# Altium schematic sheet BNC.SchDoc
size A4; SheetNumber: 1; SheetTotal: 1
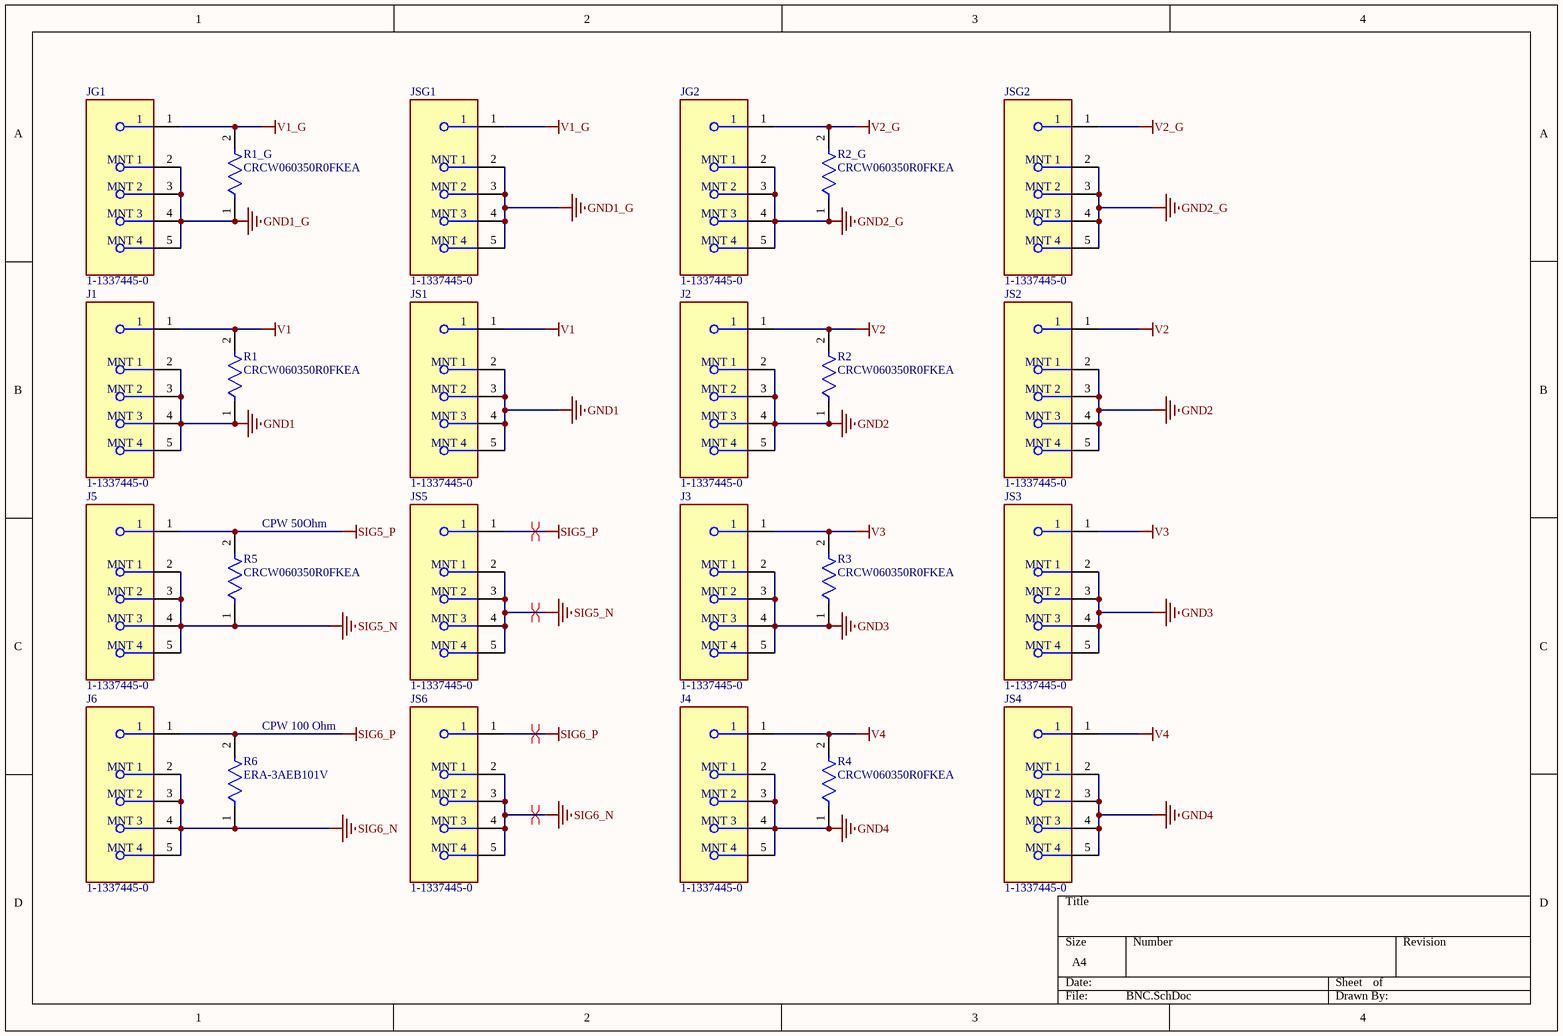
[diagram p0: BNC.SchDoc]

## Parts
J1  1-1337445-0  [FP-1-1337445-0-MFG]
J2  1-1337445-0  [FP-1-1337445-0-MFG]
J3  1-1337445-0  [FP-1-1337445-0-MFG]
J4  1-1337445-0  [FP-1-1337445-0-MFG]
J5  1-1337445-0  [FP-1-1337445-0-MFG]
J6  1-1337445-0  [FP-1-1337445-0-MFG]
JG1  1-1337445-0  [FP-1-1337445-0-MFG]
JG2  1-1337445-0  [FP-1-1337445-0-MFG]
JS1  1-1337445-0  [FP-1-1337445-0-MFG]
JS2  1-1337445-0  [FP-1-1337445-0-MFG]
JS3  1-1337445-0  [FP-1-1337445-0-MFG]
JS4  1-1337445-0  [FP-1-1337445-0-MFG]
JS5  1-1337445-0  [FP-1-1337445-0-MFG]
JS6  1-1337445-0  [FP-1-1337445-0-MFG]
JSG1  1-1337445-0  [FP-1-1337445-0-MFG]
JSG2  1-1337445-0  [FP-1-1337445-0-MFG]
R1  CRCW060350R0FKEA  [FP-CRCW0603-e3-MFG]
R1_G  CRCW060350R0FKEA  [FP-CRCW0603-e3-MFG]
R2  CRCW060350R0FKEA  [FP-CRCW0603-e3-MFG]
R2_G  CRCW060350R0FKEA  [FP-CRCW0603-e3-MFG]
R3  CRCW060350R0FKEA  [FP-CRCW0603-e3-MFG]
R4  CRCW060350R0FKEA  [FP-CRCW0603-e3-MFG]
R5  CRCW060350R0FKEA  [FP-CRCW0603-e3-MFG]
R6  ERA-3AEB101V  [FP-ERA3A-IPC_B]

## Nets
GND1: J1.2(MNT_1) J1.3(MNT_2) J1.4(MNT_3) J1.5(MNT_4) JS1.2(MNT_1) JS1.3(MNT_2) JS1.4(MNT_3) JS1.5(MNT_4) R1.1
GND1_G: JG1.2(MNT_1) JG1.3(MNT_2) JG1.4(MNT_3) JG1.5(MNT_4) JSG1.2(MNT_1) JSG1.3(MNT_2) JSG1.4(MNT_3) JSG1.5(MNT_4) R1_G.1
GND2: J2.2(MNT_1) J2.3(MNT_2) J2.4(MNT_3) J2.5(MNT_4) JS2.2(MNT_1) JS2.3(MNT_2) JS2.4(MNT_3) JS2.5(MNT_4) R2.1
GND2_G: JG2.2(MNT_1) JG2.3(MNT_2) JG2.4(MNT_3) JG2.5(MNT_4) JSG2.2(MNT_1) JSG2.3(MNT_2) JSG2.4(MNT_3) JSG2.5(MNT_4) R2_G.1
GND3: J3.2(MNT_1) J3.3(MNT_2) J3.4(MNT_3) J3.5(MNT_4) JS3.2(MNT_1) JS3.3(MNT_2) JS3.4(MNT_3) JS3.5(MNT_4) R3.1
GND4: J4.2(MNT_1) J4.3(MNT_2) J4.4(MNT_3) J4.5(MNT_4) JS4.2(MNT_1) JS4.3(MNT_2) JS4.4(MNT_3) JS4.5(MNT_4) R4.1
SIG5_N: J5.2(MNT_1) J5.3(MNT_2) J5.4(MNT_3) J5.5(MNT_4) JS5.2(MNT_1) JS5.3(MNT_2) JS5.4(MNT_3) JS5.5(MNT_4) R5.1
SIG5_P: J5.1 JS5.1 R5.2
SIG6_N: J6.2(MNT_1) J6.3(MNT_2) J6.4(MNT_3) J6.5(MNT_4) JS6.2(MNT_1) JS6.3(MNT_2) JS6.4(MNT_3) JS6.5(MNT_4) R6.1
SIG6_P: J6.1 JS6.1 R6.2
V1: J1.1 JS1.1 R1.2
V1_G: JG1.1 JSG1.1 R1_G.2
V2: J2.1 JS2.1 R2.2
V2_G: JG2.1 JSG2.1 R2_G.2
V3: J3.1 JS3.1 R3.2
V4: J4.1 JS4.1 R4.2

## Layout directives
differential pair: SIG5_N, SIG5_P, SIG6_N, SIG6_P

## Notes on the sheet
- (near R5) CPW 50Ohm
- (near R6) CPW 100 Ohm

## Library data of the parts
J1-J6 JG1 JG2 JS1-JS6 JSG1 JSG2 = CMP-03357-000006-1: CONN BNC JACK STR 50 OHM PCB; PCB Mount Retention: With; Operating Frequency: 0 to 4Hz; PCB Mounting Orientation: Vertical; PCB Thickness: 0.126inch; Body Plating: Silver; Frequency: 4GHz; Impedance: 50R; Insulation Resistance: 5GR; Body Material: Brass; Dielectric Material: PTFE; Gender: Female; Sealable: No (Without); Number of Positions: 1; Orientation: Straight; RoHS Compliant: Yes; Min Operating Temperature: -65°C; Packaging: Bag; Fastening Type: Bayonet; Radiation Hardening: No; Max Frequency: 4GHz; Material: Brass; Contact Plating: Silver; ELV: Compliant; Depth: 12mm; Series: BNC; Package Quantity: 50; Connector Type: BNC; Contact Material: Brass; Max Operating Temperature: 165°C; Length: 12mm; Termination: Solder; Mount: Through Hole; Insulation Material: Polytetrafluoroethylene
R1 R1_G R2 R2_G R3-R5 = CMP-2000-03436-2: RES Thick Film, 50Ω, 1%, 0.1W, 100ppm/°C, 0603; Voltage Rating (DC): 75V; Resistance: 50R; Power Rating: 100mW; Case/Package: 0603; Packaging: Tape and Reel; Military Standard: Not; REACH SVHC: No SVHC; Width: 0.85mm; Max Operating Temperature: 155°C; Case Code (Metric): 1608; Temperature Coefficient: 100ppm/°C; Lead Free: Lead Free; Height: 0.45mm; Composition: Thick Film; Termination: SMD/SMT; Contact Plating: Tin; Number of Pins: 2; Tolerance: 1%; Depth: 0.85mm; Weight: 7.1E-05oz; Min Operating Temperature: -55°C; Length: 1.55mm; Radiation Hardening: No; Voltage Rating: 75V; Case Code (Imperial): 0603; Package Quantity: 5000; Mount: Surface Mount
R6 = CMP-2000-00870-2: RES SMD 100 OHM 0.1% 1/10W 0603; Voltage Rating: 75V; Power Rating: 100mW; Resistance: 100R; Temperature Coefficient: 25ppm/°C; Number of Terminations: 2; Case/Package: 0603; Termination: SMD/SMT; Number of Pins: 2; Size Code: 0603; Length: 1.6mm; Min Operating Temperature: -55°C; Resistor Type: Thin Film; Depth: 0.8mm; Military Standard: Not; Packaging: Tape and Reel; RoHS Compliant: Yes; Construction: Rectangular; Resistance Tolerance: 0.1%; Contact Plating: Tin; Width: 0.8mm; Mount: Surface Mount; Case Code (Metric): 1608; Max Operating Temperature: 155°C; Height: 0.45mm; Case Code (Imperial): 0603; Series: ERA-3A; Package Quantity: 5000; REACH SVHC: No SVHC; Tolerance: 0.1%; Max Power Dissipation: 100mW; Radiation Hardening: No; Technology: METAL FILM